# EAGLE board PX4uNode_V0_1_3 (EAGLE 6.5.0), part 1 of 2
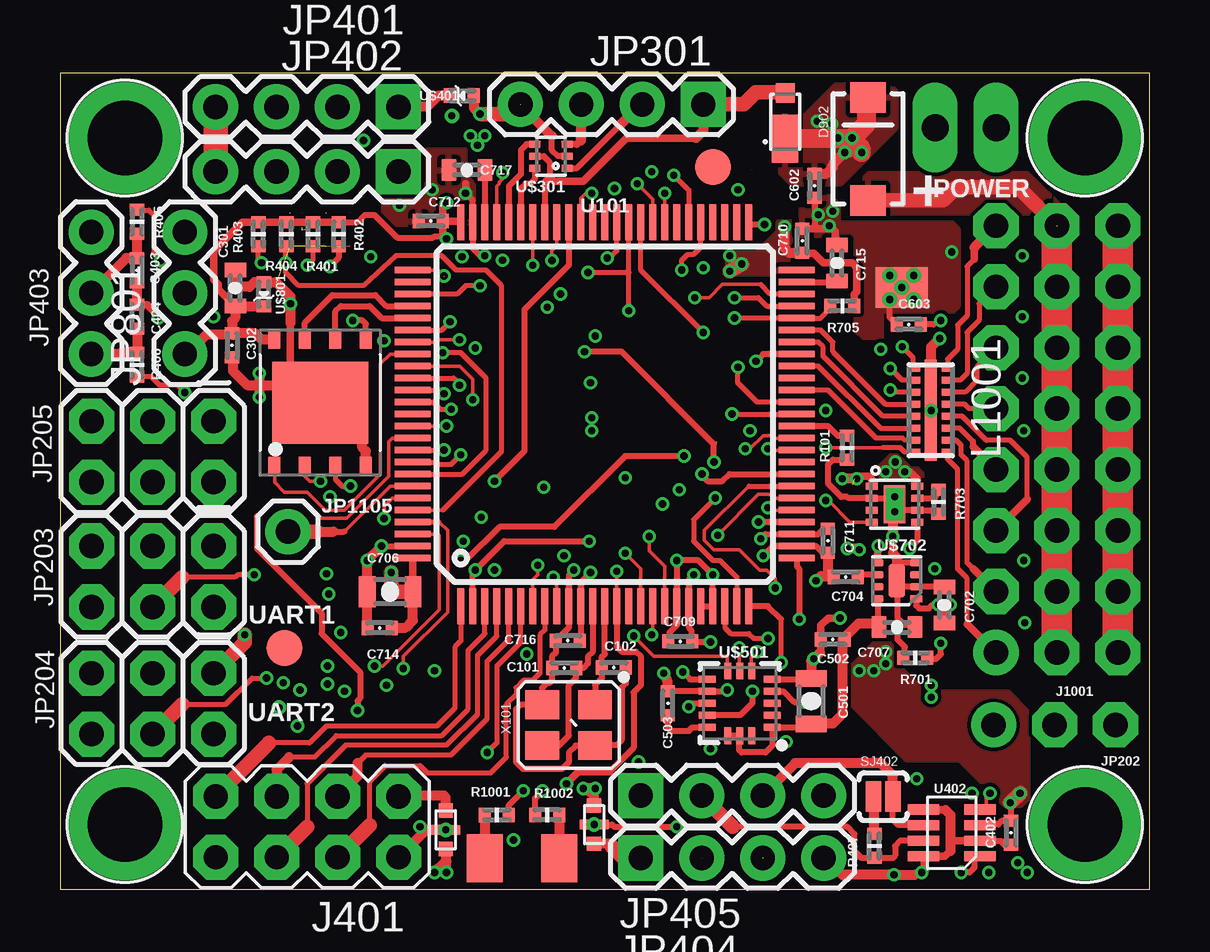
[diagram p11: board, top side]
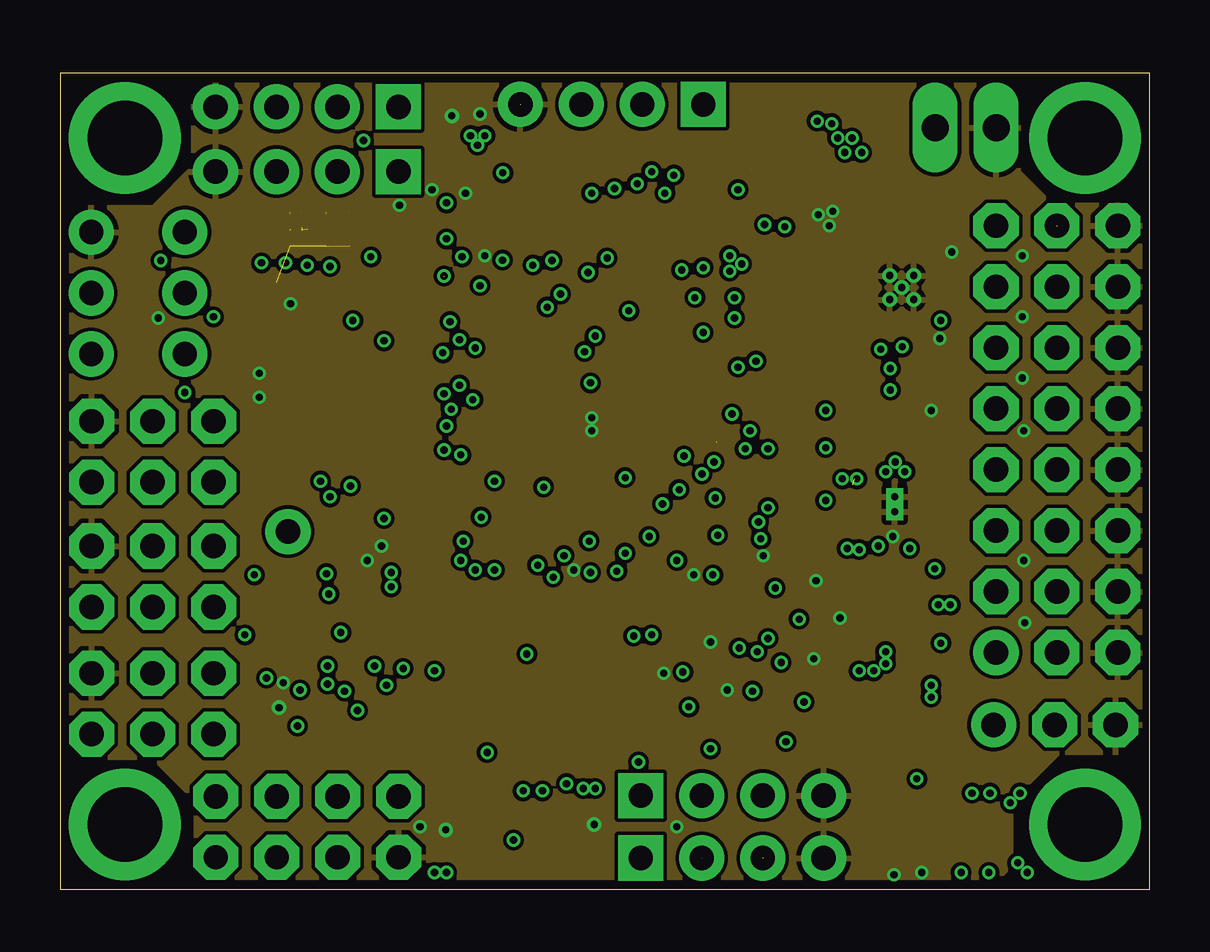
[diagram p12: board, inner layer Ground]
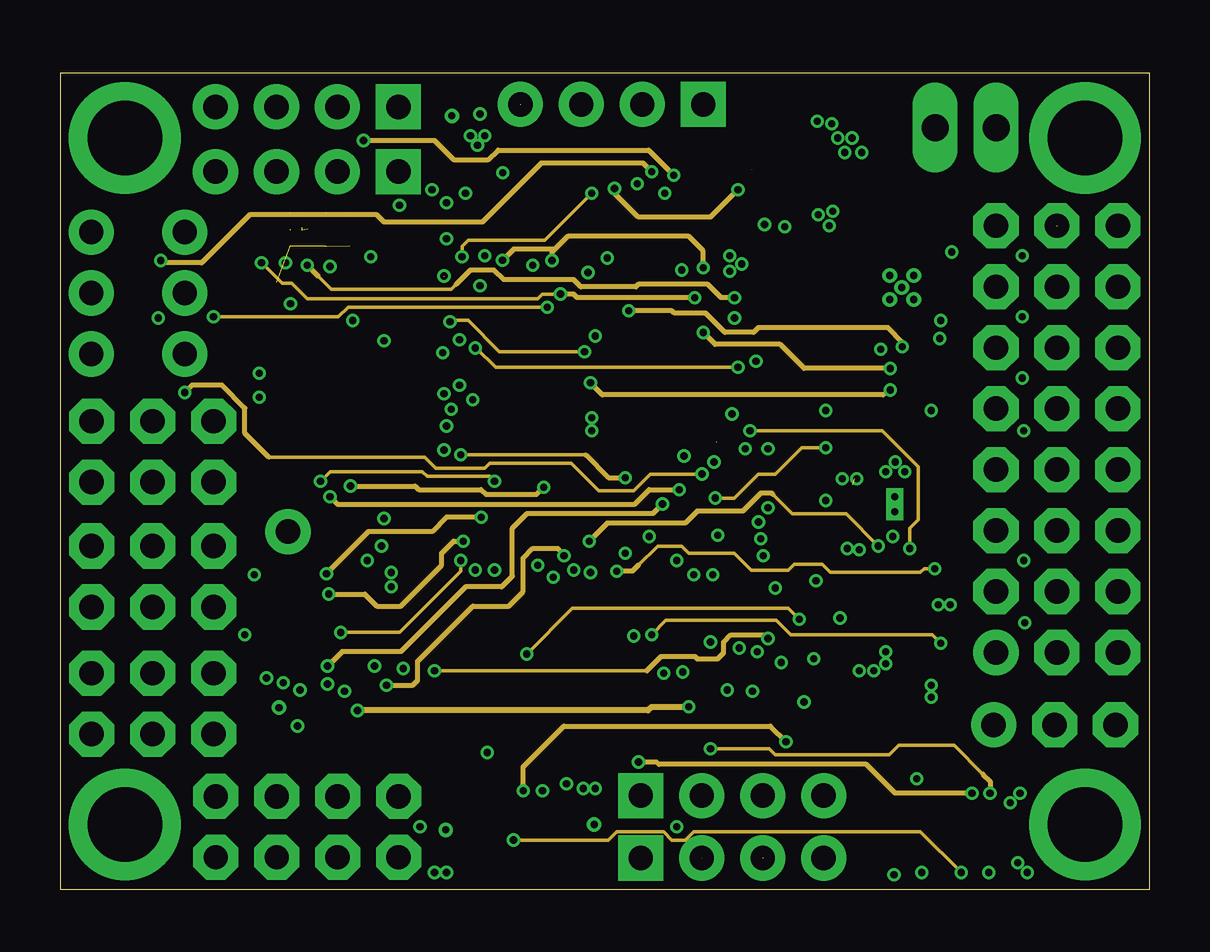
[diagram p13: board, inner layer Horizontal]
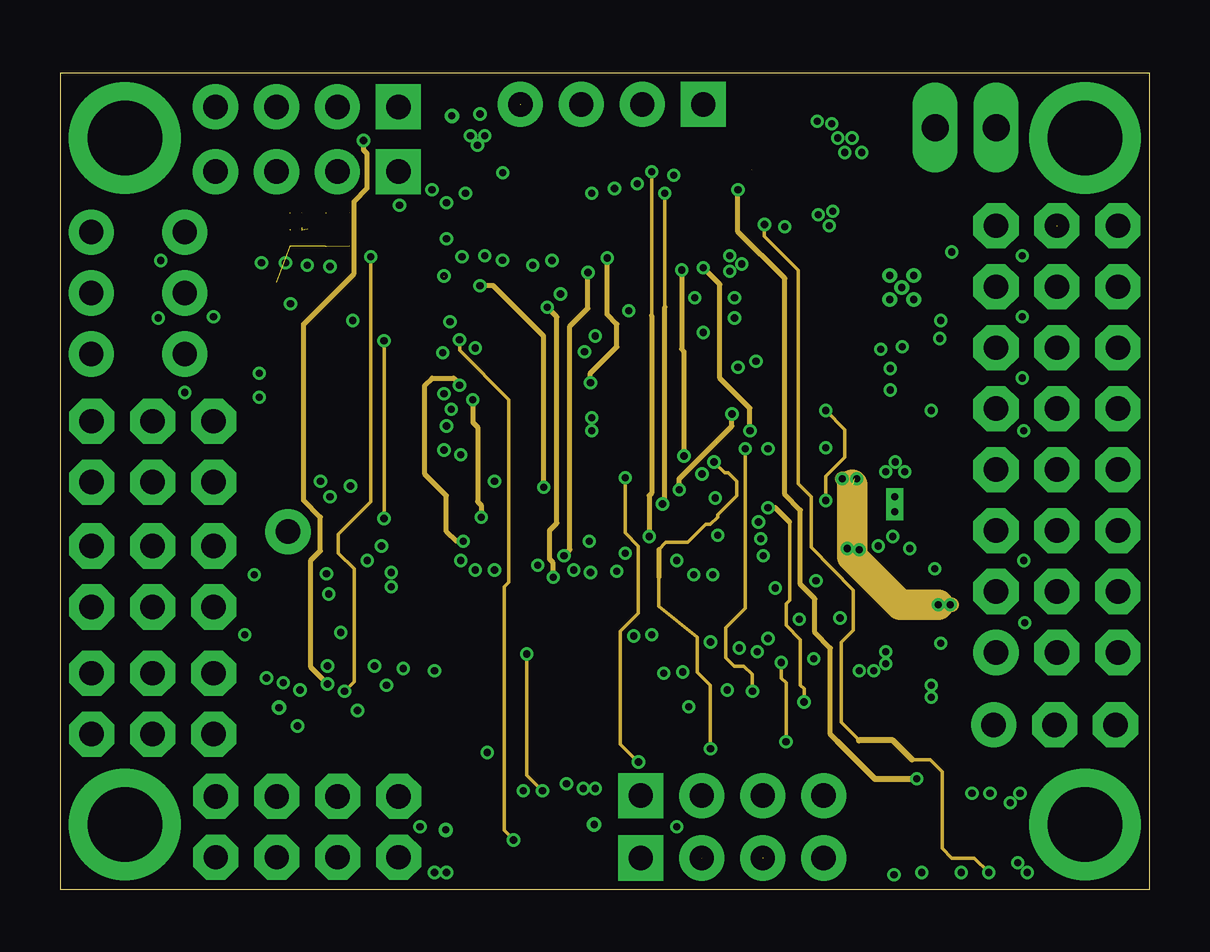
[diagram p14: board, inner layer Vertical]
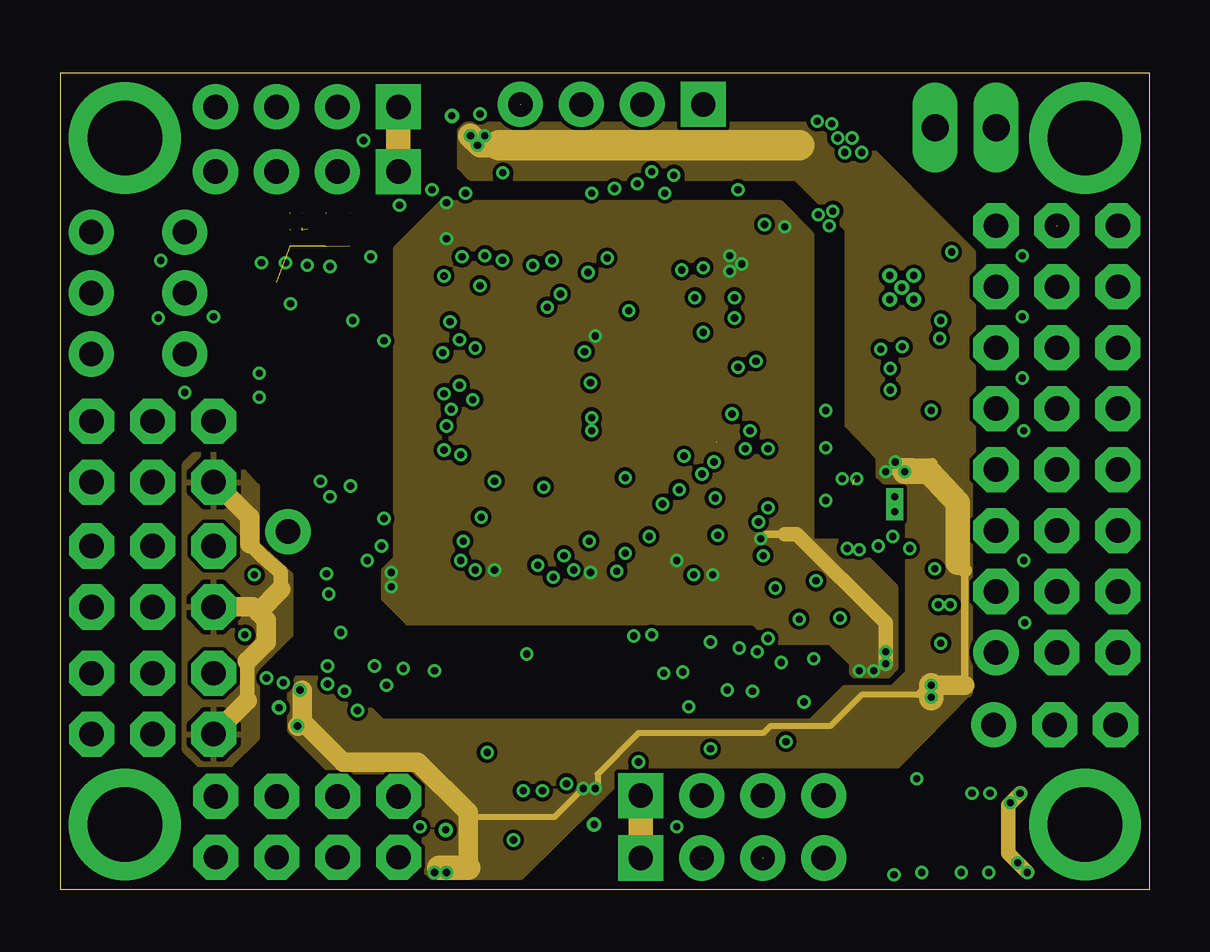
[diagram p15: board, inner layer Power]
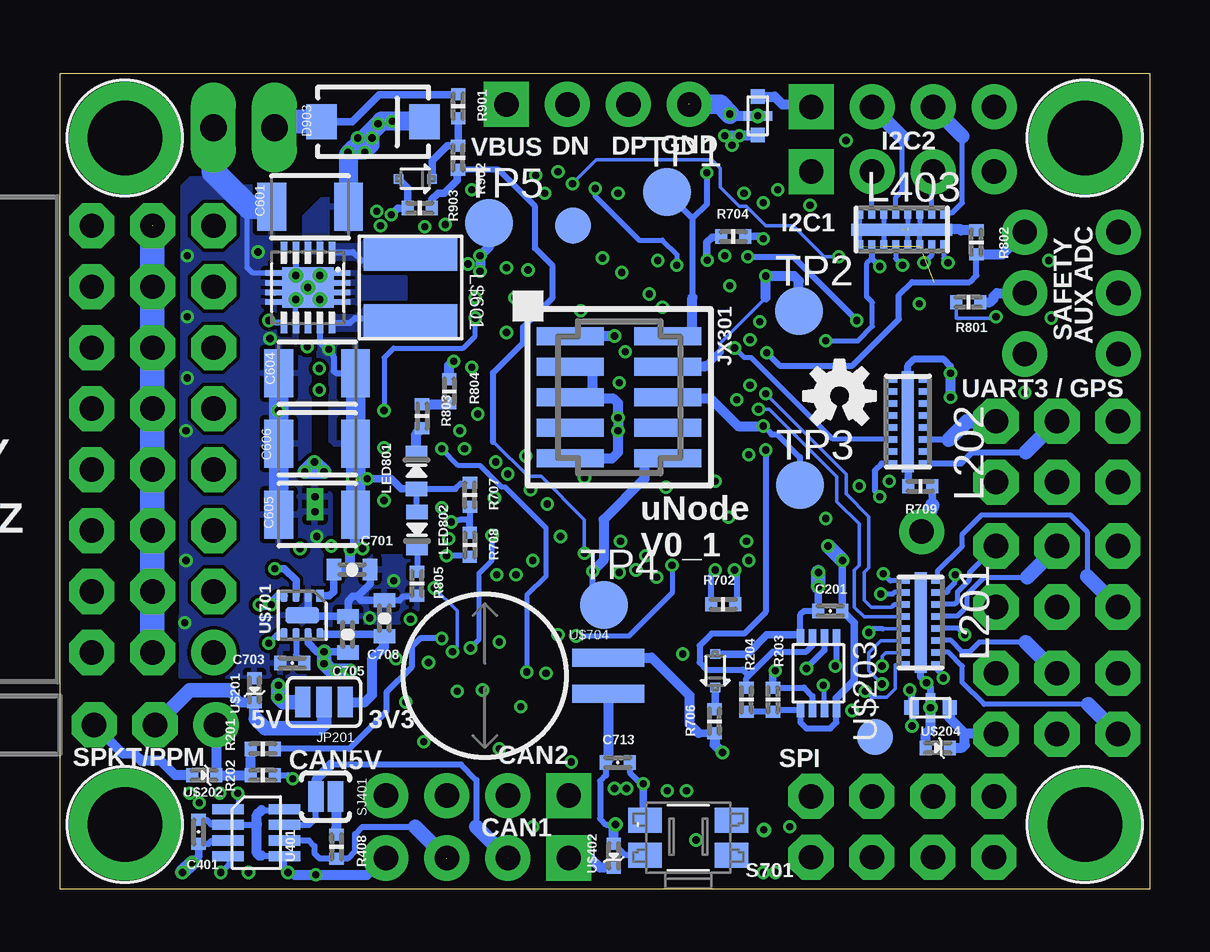
[diagram p16: board, bottom side, seen from below]

Size 45.4 x 34 mm. Coordinates in mm from the lower left corner, seen from the top.
Outline: 0,0 45.4,0 45.4,34 0,34 0,0
Copper layers (1+2+3*14+15+16): Top 0.035mm / dielectric 0.2mm / Ground 0.035mm / dielectric 0.36mm / Horizontal 0.035mm / dielectric 0.28mm / Vertical 0.035mm / dielectric 0.36mm / Power 0.035mm / dielectric 0.2mm / Bottom 0.035mm
Design rules "PCB-POOL HighSpec_ML6 *": minimum track width 0.125mm, minimum drill 0.3mm, track to track 0.125mm, track to pad 0.125mm, pad to pad 0.125mm, via to via 0.125mm, smd to smd 0.125mm, copper to edge 0.3mm, drill to drill 0.2mm, minimum pad ring 0.125mm, minimum via ring 0.125mm, stop-mask expansion 0.075mm, vias tented up to drill 0.31mm, thermal gap 0.2mm
Net classes: 0 signal: width 0.152 mm, drill 0.2 mm, clearance 0.152 mm; 1 power: width 0.254 mm, drill 0.3 mm, clearance 0.152 mm

## Footprints (pad centres in the part's own frame; a part is rotated, then mirrored left to right if it is on the bottom)
0402-CAP = smd 0.5 x 0.6: P$1 -0.5,0; P$2 0.5,0
0603-CAP = smd 0.6 x 0.9: P$1 -0.75,0; P$2 0.75,0
0805-CAP = smd 0.7 x 1.3: P$1 -0.95,0; P$2 0.95,0
1210 = smd 1.2 x 2: 1 -1.6,0; 2 1.6,0
SOD-523 = smd 0.4 x 0.4: A -0.7,0; C 0.7,0
SMA-DIODE = smd 1.27 x 1.47: A -2.15,0; C 2.15,0
MICROSMP = smd 0.8 x 0.8: ANODE 0.65,0 | smd 2 x 1.1: CATHODE -1.25,0
2X4 = drill 1.016 pad 1.88 octagon: 1 -3.81,-1.27; 2 -3.81,1.27; 3 -1.27,-1.27; 4 -1.27,1.27; 5 1.27,-1.27; 6 1.27,1.27; 7 3.81,-1.27; 8 3.81,1.27
3X8RA_SERVO = drill 1.016 pad 1.88 octagon: GND_S1 -3.81,8.89; GND_S2 -3.81,6.35; GND_S3 -3.81,3.81; GND_S4 -3.81,1.27; GND_S5 -3.81,-1.27; GND_S6 -3.81,-3.81; GND_S7 -3.81,-6.35; GND_S8 -3.81,-8.89; PWR_S1 -1.27,8.89; PWR_S2 -1.27,6.35; PWR_S3 -1.27,3.81; PWR_S4 -1.27,1.27; PWR_S5 -1.27,-1.27; PWR_S6 -1.27,-3.81; PWR_S7 -1.27,-6.35; PWR_S8 -1.27,-8.89; S2 1.27,6.35; S3 1.27,3.81; S4 1.27,1.27; S5 1.27,-1.27; S6 1.27,-3.81; S7 1.27,-6.35; S8 1.27,-8.89 | drill 1.016 pad 1.88: S1 1.27,8.89
SJ_3 = smd 0.635 x 1.27: 1 -0.889,0; 2 0,0; 3 0.889,0
3X1RA = drill 1.016 pad 1.88: 1 5.08,0 | drill 1.016 pad 1.88 octagon: 2 2.54,0; 3 0,0
2X3 = drill 1.016 pad 1.88 octagon: 1 0,0; 2 0,2.54; 3 2.54,0; 4 2.54,2.54; 5 5.08,0; 6 5.08,2.54
1X04 = drill 1.016 pad 1.88 square: 1 0,0 | drill 1.016 pad 1.88: 2 2.54,0; 3 5.08,0; 4 7.62,0
1X03 = drill 1.016 pad 1.88: 1 0,0; 2 2.54,0; 3 5.08,0
1X02_LONGPADS = drill 1.118 pad 1.88 long: 1 0,0; 2 2.54,0
PAD-1.5X4.5 = smd 1.5 x 2: P$1 0,0
FIDUCIAL-1.5X3 = smd 1.5 x 1.5: 1 0,0
1X01 = drill 1.016 pad 1.88: 1 0,0
FTSH-105-01-XXX-DV-K = smd 0.737 x 2.794: 1 -2.54,-2.032; 2 -2.54,2.032; 3 -1.27,-2.032; 4 -1.27,2.032; 5 0,-2.032; 6 0,2.032; 7 1.27,-2.032; 8 1.27,2.032; 9 2.54,-2.032; 10 2.54,2.032
DFN16-THIN = smd 0.28 x 0.51: P$1 -1.75,-0.7; P$2 -1.25,-0.7; P$3 -0.75,-0.7; P$4 -0.25,-0.7; P$5 0.25,-0.7; P$6 0.75,-0.7; P$7 1.25,-0.7; P$8 1.75,-0.7; P$9 1.75,0.7; P$10 1.25,0.7; P$11 0.75,0.7; P$12 0.25,0.7; P$13 -0.25,0.7; P$14 -0.75,0.7; P$15 -1.25,0.7; P$16 -1.75,0.7 | smd 4.2 x 0.5: P$EP 0,0
KYOCERA-KNH16-DA = smd 0.6 x 0.6: P$1 -0.8,0; P$2 0.8,0 | smd 0.4 x 0.4: P$3 0,-0.4; P$4 0,0.4 | drill 0.3 pad 0.6: P$5 0,0
IND_4X4_MULTI = smd 1.35 x 3.9: 1 -1.375,0; 2 1.375,0
0603-LED = smd 0.6 x 0.9: A 0.75,0; C -0.75,0
MOUNT-HOLE3.1 = drill 3.1 pad 4.1: P$1 0,0
0402-RES = smd 0.5 x 0.6: P$1 -0.5,0; P$2 0.5,0
EVQP7J01K = smd 1.4 x 1.05: A1 -1.8,0.725; A2 1.8,0.725; B3 -1.8,-0.725; B4 1.8,-0.725
SJ_2S-NOTRACE = smd 0.635 x 1.27: 1 -0.401,0; 2 0.413,0
TP20R = smd 2 x 2: TP 0,0
TQFP100 = smd 1.5 x 0.29: 1 -8,6; 2 -8,5.5; 3 -8,5; 4 -8,4.5; 5 -8,4; 6 -8,3.5; 7 -8,3; 8 -8,2.5; 9 -8,2; 10 -8,1.5; 11 -8,1; 12 -8,0.5; 13 -8,0; 14 -8,-0.5; 15 -8,-1; 16 -8,-1.5; 17 -8,-2; 18 -8,-2.5; 19 -8,-3; 20 -8,-3.5; 21 -8,-4; 22 -8,-4.5; 23 -8,-5; 24 -8,-5.5; 25 -8,-6; 51 8,-6; 52 8,-5.5; 53 8,-5; 54 8,-4.5; 55 8,-4; 56 8,-3.5; 57 8,-3; 58 8,-2.5; 59 8,-2; 60 8,-1.5; 61 8,-1; 62 8,-0.5; 63 8,0; 64 8,0.5; 65 8,1; 66 8,1.5; 67 8,2; 68 8,2.5; 69 8,3; 70 8,3.5; 71 8,4; 72 8,4.5; 73 8,5; 74 8,5.5; 75 8,6 | smd 0.29 x 1.5: 26 -6,-8; 27 -5.5,-8; 28 -5,-8; 29 -4.5,-8; 30 -4,-8; 31 -3.5,-8; 32 -3,-8; 33 -2.5,-8; 34 -2,-8; 35 -1.5,-8; 36 -1,-8; 37 -0.5,-8; 38 0,-8; 39 0.5,-8; 40 1,-8; 41 1.5,-8; 42 2,-8; 43 2.5,-8; 44 3,-8; 45 3.5,-8; 46 4,-8; 47 4.5,-8; 48 5,-8; 49 5.5,-8; 50 6,-8; 76 6,8; 77 5.5,8; 78 5,8; 79 4.5,8; 80 4,8; 81 3.5,8; 82 3,8; 83 2.5,8; 84 2,8; 85 1.5,8; 86 1,8; 87 0.5,8; 88 0,8; 89 -0.5,8; 90 -1,8; 91 -1.5,8; 92 -2,8; 93 -2.5,8; 94 -3,8; 95 -3.5,8; 96 -4,8; 97 -4.5,8; 98 -5,8; 99 -5.5,8; 100 -6,8
SOT23-8 = smd 0.42 x 1.3: 1 -0.975,-1.175; 2 -0.325,-1.175; 3 0.325,-1.175; 4 0.975,-1.175; 5 0.975,1.175; 6 0.325,1.175; 7 -0.325,1.175; 8 -0.975,1.175
0402-TVS = smd 0.5 x 0.6: A 0.5,0; C -0.5,0
VSSOP8 = smd 0.3 x 0.55: 1 -0.75,-1.55; 2 -0.25,-1.55; 3 0.25,-1.55; 4 0.75,-1.55; 5 0.75,1.55; 6 0.25,1.55; 7 -0.25,1.55; 8 -0.75,1.55
SOT563-6 = smd 0.3 x 0.45: 1 -0.5,-0.675; 2 0,-0.675; 3 0.5,-0.675; 4 0.5,0.675; 5 0,0.675; 6 -0.5,0.675
WSON-8-5X6 = smd 0.5 x 0.75: 1 -1.905,-2.625; 2 -0.635,-2.625; 3 0.635,-2.625; 4 1.905,-2.625; 5 1.905,2.625; 6 0.635,2.625; 7 -0.635,2.625; 8 -1.905,2.625 | smd 4 x 3.4: PAD 0,0
16LGA-3X3 = smd 0.7 x 0.3: 1 -1.35,1; 2 -1.35,0.5; 3 -1.35,0; 4 -1.35,-0.5; 5 -1.35,-1; 9 1.35,-1; 10 1.35,-0.5; 11 1.35,0; 12 1.35,0.5; 13 1.35,1 | smd 0.3 x 0.7: 6 -0.5,-1.35; 7 0,-1.35; 8 0.5,-1.35; 14 0.5,1.35; 15 0,1.35; 16 -0.5,1.35
PWSON10 = smd 0.28 x 0.85: 1 -1,-1.475; 2 -0.5,-1.475; 3 0,-1.475; 4 0.5,-1.475; 5 1,-1.475; 10 1,1.475; 11 0.5,1.475; 12 0,1.475; 13 -0.5,1.475; 14 -1,1.475 | smd 0.7 x 0.23: 6 1.425,-0.6; 7 1.425,-0.2; 8 1.425,0.2; 9 1.425,0.6; 15 -1.425,0.6; 16 -1.425,0.2; 17 -1.425,-0.2; 18 -1.425,-0.6 | drill 0.3 pad 0.61: 19 0.5,0.5; 20 0.5,-0.5; 21 -0.5,-0.5; 22 -0.5,0.5; 23 0,0 | smd 2.15 x 1.7: EP 0,0 | smd 2.15 x 1.7 bottom: EP1 0,0
MLF-8-EPAD = smd 0.5 x 0.3: 1 -0.8,0.75; 2 -0.8,0.25; 3 -0.8,-0.25; 4 -0.8,-0.75; 5 0.8,-0.75; 6 0.8,-0.25; 7 0.8,0.25; 8 0.8,0.75 | smd 0.7 x 1.4: GND 0,0
QFN8-DSG = smd 0.28 x 0.5: 1 -0.75,-0.95; 2 -0.25,-0.95; 3 0.25,-0.95; 4 0.75,-0.95; 5 0.75,0.95; 6 0.25,0.95; 7 -0.25,0.95; 8 -0.75,0.95 | smd 1.6 x 0.9: GND 0,0 | drill 0.3 pad 0.7 square: P$2 -0.317,0; P$3 0.317,0
MS621FE = smd 3 x 0.75: 1 5.15,0.75; 2 5.15,-0.75
OSCILLATOR-3.2X2.5 = smd 1.4 x 1.2: 1 -1.1,-0.85; 2 1.1,-0.85; 3 1.1,0.85; 4 -1.1,0.85

## Placement (x,y rotation side)
C101  16p  [0402-CAP]  21.01,9.21 180 top
C102  16p  [0402-CAP]  23.08,9.23 180 top
C201  0u1  [0402-CAP]  13.3,11.6 0 bottom
C301  2u2  [0603-CAP]  7.31,25.05 90 top
C302  0u1  [0402-CAP]  7.17,22.66 270 top
C401  0u1  [0402-CAP]  39.62,2.38 90 bottom
C402  0u1  [0402-CAP]  39.62,2.35 270 top
C403  0u1  [0402-CAP]  3.21,25.8 270 top
C404  0u1  [0402-CAP]  3.21,23.86 90 top
C501  10u/10V  [0805-CAP]  31.3,7.83 90 top
C502  10n  [0402-CAP]  32.19,10.41 180 top
C503  0u1  [0402-CAP]  25.32,7.74 90 top
C601  22uF  [1210]  34.98,28.43 180 bottom
C602  0u1  [0402-CAP]  31.44,29.32 270 top
C603  0u1  [0402-CAP]  35.37,23.54 180 top
C604  22uF  [1210]  34.68,21.5 180 bottom
C605  22uF  [1210]  34.68,15.6 180 bottom
C606  22uF  [1210]  34.68,18.55 180 bottom
C701  2u2  [0603-CAP]  33.23,13.32 0 bottom
C702  1u0  [0603-CAP]  36.85,11.84 90 top
C703  10n  [0402-CAP]  35.72,9.42 0 bottom
C704  10n  [0402-CAP]  32.73,13.01 180 top
C705  1u0  [0603-CAP]  33.41,10.62 90 bottom
C706  10u/10V  [0805-CAP]  13.76,12.4 180 top
C707  1u0  [0603-CAP]  34.87,10.92 0 top
C708  1u0  [0603-CAP]  31.88,11.29 90 bottom
C709  0u1  [0402-CAP]  25.85,10.33 0 top
C710  0u1  [0402-CAP]  30.93,27.02 90 top
C711  0u1  [0402-CAP]  31.99,14.52 270 top
C712  0u1  [0402-CAP]  15.45,27.84 180 top
C713  0u1  [0402-CAP]  22.16,5.28 0 bottom
C714  0u1  [0402-CAP]  13.33,10.89 180 top
C715  2u2  [0603-CAP]  32.38,26.09 90 top
C716  0u1  [0402-CAP]  21.16,10.35 180 top
C717  2u2  [0603-CAP]  16.95,29.97 180 top
D701  DIODE-SCHOTTKY  [SOD-523]  18.1,9.1 270 bottom
D901  DIODE-SCHOTTKY  [SOD-523]  30.6,29.6 0 bottom
D902  B340A  [SMA-DIODE]  33.67,30.85 90 top
D903  B340A  [SMA-DIODE]  32.35,31.98 0 bottom
D904  MSS1P4-M3  [MICROSMP]  30.22,32.52 90 top
J401  M04X2  [2X4]  10.3,2.6 0 top
J1001  [3X8RA_SERVO]  40.27,18.75 180 top
JP201  JUMPER-3SMD  [SJ_3]  34.4,7.8 180 bottom
JP202  HEADER-3X1RA  [3X1RA]  43.98,6.84 180 top
JP203  [2X3]  6.4,14.3 180 top
JP204  [2X3]  6.4,9 180 top
JP205  [2X3]  6.4,19.5 180 top
JP301  [1X04]  26.8,32.7 180 top
JP401  [1X04]  14.1,32.6 180 top
JP402  [1X04]  14.1,29.9 180 top
JP403  [1X03]  1.3,22.3 90 top
JP404  [1X04]  24.2,1.3 0 top
JP405  [1X04]  24.2,3.9 0 top
JP801  [1X03]  5.2,22.3 90 top
JP901  M02PTH3  [1X02_LONGPADS]  36.47,31.73 0 top
JP1001  M01SMD-4.5X1.5  [PAD-1.5X4.5]  17.7,1.3 0 top
JP1002  M01SMD-4.5X1.5  [PAD-1.5X4.5]  20.8,1.3 0 top
JP1101  FIDUCIAL1.5X3  [FIDUCIAL-1.5X3]  11.45,6.35 90 bottom
JP1102  FIDUCIAL1.5X3  [FIDUCIAL-1.5X3]  24.03,27.65 0 bottom
JP1103  FIDUCIAL1.5X3  [FIDUCIAL-1.5X3]  9.35,10.05 0 top
JP1104  FIDUCIAL1.5X3  [FIDUCIAL-1.5X3]  27.2,30.1 0 top
JP1105  M01PTH  [1X01]  9.5,14.9 0 top
JX301  ARM_MINI_JTAG-SMT  [FTSH-105-01-XXX-DV-K]  22.1,20.5 270 bottom
L201  NUF8402MN  [DFN16-THIN]  9.54,11.12 270 bottom
L202  NUF8402MN  [DFN16-THIN]  10.07,19.48 270 bottom
L203  KNH16C104DA5TS  [KYOCERA-KNH16-DA]  9.13,7.56 0 bottom
L401  KNH16C104DA5TS  [KYOCERA-KNH16-DA]  16.07,2.47 90 top
L402  KNH16C104DA5TS  [KYOCERA-KNH16-DA]  16.33,32.22 90 bottom
L403  NUF8402MN  [DFN16-THIN]  10.33,27.49 0 bottom
L404  KNH16C104DA5TS  [KYOCERA-KNH16-DA]  22.26,2.69 270 top
L1001  NUF8402MN  [DFN16-THIN]  36.28,19.96 270 top
L$601  IND_4X4_MULTI  [IND_4X4_MULTI]  30.8,25.07 90 bottom
LED801  AMBER  [0603-LED]  30.55,17.43 270 bottom
LED802  GREEN  [0603-LED]  30.52,14.97 90 bottom
M3_MOUNT1101  MOUNT-HOLE3.1MM  [MOUNT-HOLE3.1]  2.7,31.3 0 top
M3_MOUNT1102  MOUNT-HOLE3.1MM  [MOUNT-HOLE3.1]  42.7,2.7 0 top
M3_MOUNT1103  MOUNT-HOLE3.1MM  [MOUNT-HOLE3.1]  42.7,31.3 0 top
M3_MOUNT1104  MOUNT-HOLE3.1MM  [MOUNT-HOLE3.1]  2.7,2.7 0 top
OSHW_LOGO  OSHW-LOGOS  [OSHW-LOGO-S]  12.92,20.55 0 bottom
R101  10K  [0402-RES]  32.79,18.39 270 top
R201  120R  [0402-RES]  36.95,5.85 180 bottom
R202  120R  [0402-RES]  36.95,4.75 180 bottom
R203  10K  [0402-RES]  15.7,7.9 270 bottom
R204  10K  [0402-RES]  16.8,7.9 90 bottom
R401  1K5  [0402-RES]  10.55,27.29 90 top
R402  1K5  [0402-RES]  11.61,27.29 90 top
R403  1K5  [0402-RES]  8.27,27.29 90 top
R404  1K5  [0402-RES]  9.43,27.29 90 top
R405  10K/0.1%  [0402-RES]  3.21,27.81 270 top
R406  10K/0.1%  [0402-RES]  3.21,21.85 90 top
R407  120R  [0402-RES]  33.93,1.8 90 top
R408  120R  [0402-RES]  33.88,1.77 270 bottom
R701  10K  [0402-RES]  35.64,9.64 0 top
R702  10K  [0402-RES]  17.77,11.87 0 bottom
R703  47K  [0402-RES]  36.61,16.14 270 top
R704  10K  [0402-RES]  17.35,27.19 180 bottom
R705  10K  [0402-RES]  32.6,24.3 180 top
R706  1K  [0402-RES]  18.13,6.99 90 bottom
R707  10K/0.1%  [0402-RES]  28.32,16.43 90 bottom
R708  10K/0.1%  [0402-RES]  28.33,14.34 270 bottom
R709  10K  [0402-RES]  9.55,16.79 0 bottom
R801  47R  [0402-RES]  7.55,24.46 180 bottom
R802  1K5  [0402-RES]  7.22,26.95 90 bottom
R803  220R  [0402-RES]  30.31,19.71 270 bottom
R804  220R  [0402-RES]  29.18,20.75 270 bottom
R805  220R  [0402-RES]  30.52,12.74 90 bottom
R901  10K/0.1%  [0402-RES]  28.81,32.62 90 bottom
R902  10K/0.1%  [0402-RES]  28.82,30.48 90 bottom
R903  10K/0.1%  [0402-RES]  30.41,28.38 0 bottom
R1001  220R  [0402-RES]  18.2,3.1 0 top
R1002  220R  [0402-RES]  20.3,3.1 180 top
S701  RESET  [EVQP7J01K]  19.22,2.14 0 bottom
SJ401  SOLDERJUMPERNC2  [SJ_2S-NOTRACE]  34.33,3.86 0 bottom
SJ402  SOLDERJUMPERNC2  [SJ_2S-NOTRACE]  34.3,3.86 0 top
TP1  TPTP20R  [TP20R]  20.1,29.05 0 bottom
TP2  TPTP20R  [TP20R]  14.61,24.09 0 bottom
TP3  TPTP20R  [TP20R]  14.57,16.84 0 bottom
TP4  TPTP20R  [TP20R]  22.74,11.85 0 bottom
TP5  TPTP20R  [TP20R]  27.53,27.75 0 bottom
U101  STM32F4X7VX  [TQFP100]  22.7,19.8 90 top
U401  MAX3051  [SOT23-8]  37.22,2.36 270 bottom
U402  MAX3051  [SOT23-8]  37.15,2.34 90 top
U$201  PESD0402-140  [0402-TVS]  37.3,8.3 90 bottom
U$202  PESD0402-140  [0402-TVS]  39.4,4.75 180 bottom
U$203  74LVC2G240  [VSSOP8]  13.8,9 0 bottom
U$204  PESD0402-140  [0402-TVS]  8.82,5.89 180 bottom
U$301  NUF2042XV6  [SOT563-6]  20.46,30.54 90 top
U$302  W25Q64FV  [WSON-8-5X6]  10.84,20.27 0 top
U$401  PESD0402-140  [0402-TVS]  16.75,33.06 0 top
U$402  PESD0402-140  [0402-TVS]  22.33,1.39 90 bottom
U$501  MAX21100  [16LGA-3X3]  28.32,7.75 180 top
U$601  TPS6303X  [PWSON10]  35.07,25.07 180 bottom
U$701  MIC5332  [MLF-8-EPAD]  35.31,11.42 270 bottom
U$702  MIC5332  [MLF-8-EPAD]  34.87,12.85 180 top
U$703  BQ24315  [QFN8-DSG]  34.78,16.04 270 top
U$704  MS621FE  [MS621FE]  27.7,8.9 0 bottom
U$801  PESD0402-140  [0402-TVS]  8.49,24.78 90 top
X101  3.2x2.5 mm / 24 MHz / 30 ppm / 10pF  [OSCILLATOR-3.2X2.5]  21.19,6.84 180 top